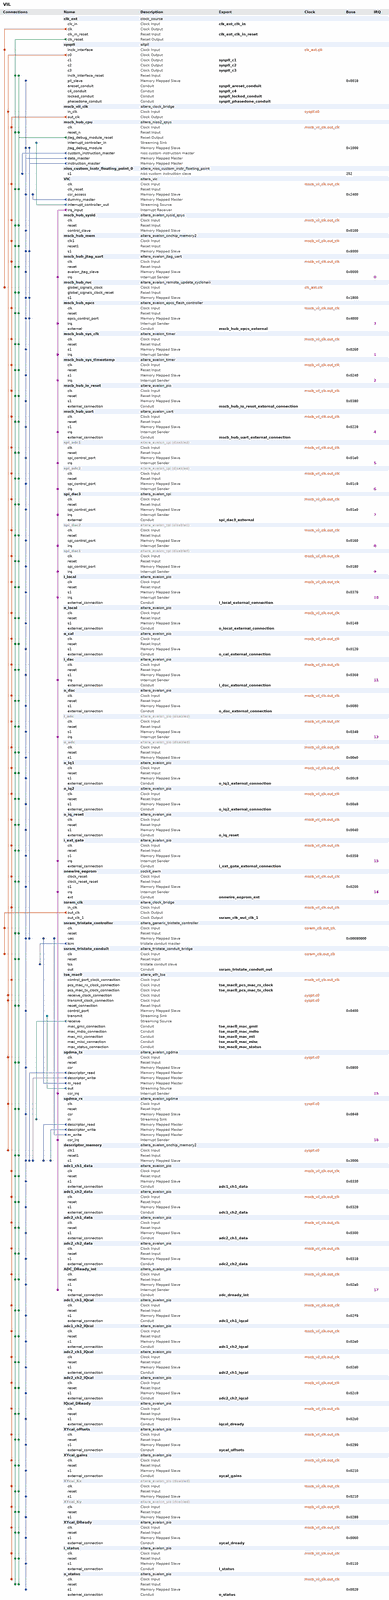
[diagram p0: system contents, whole]
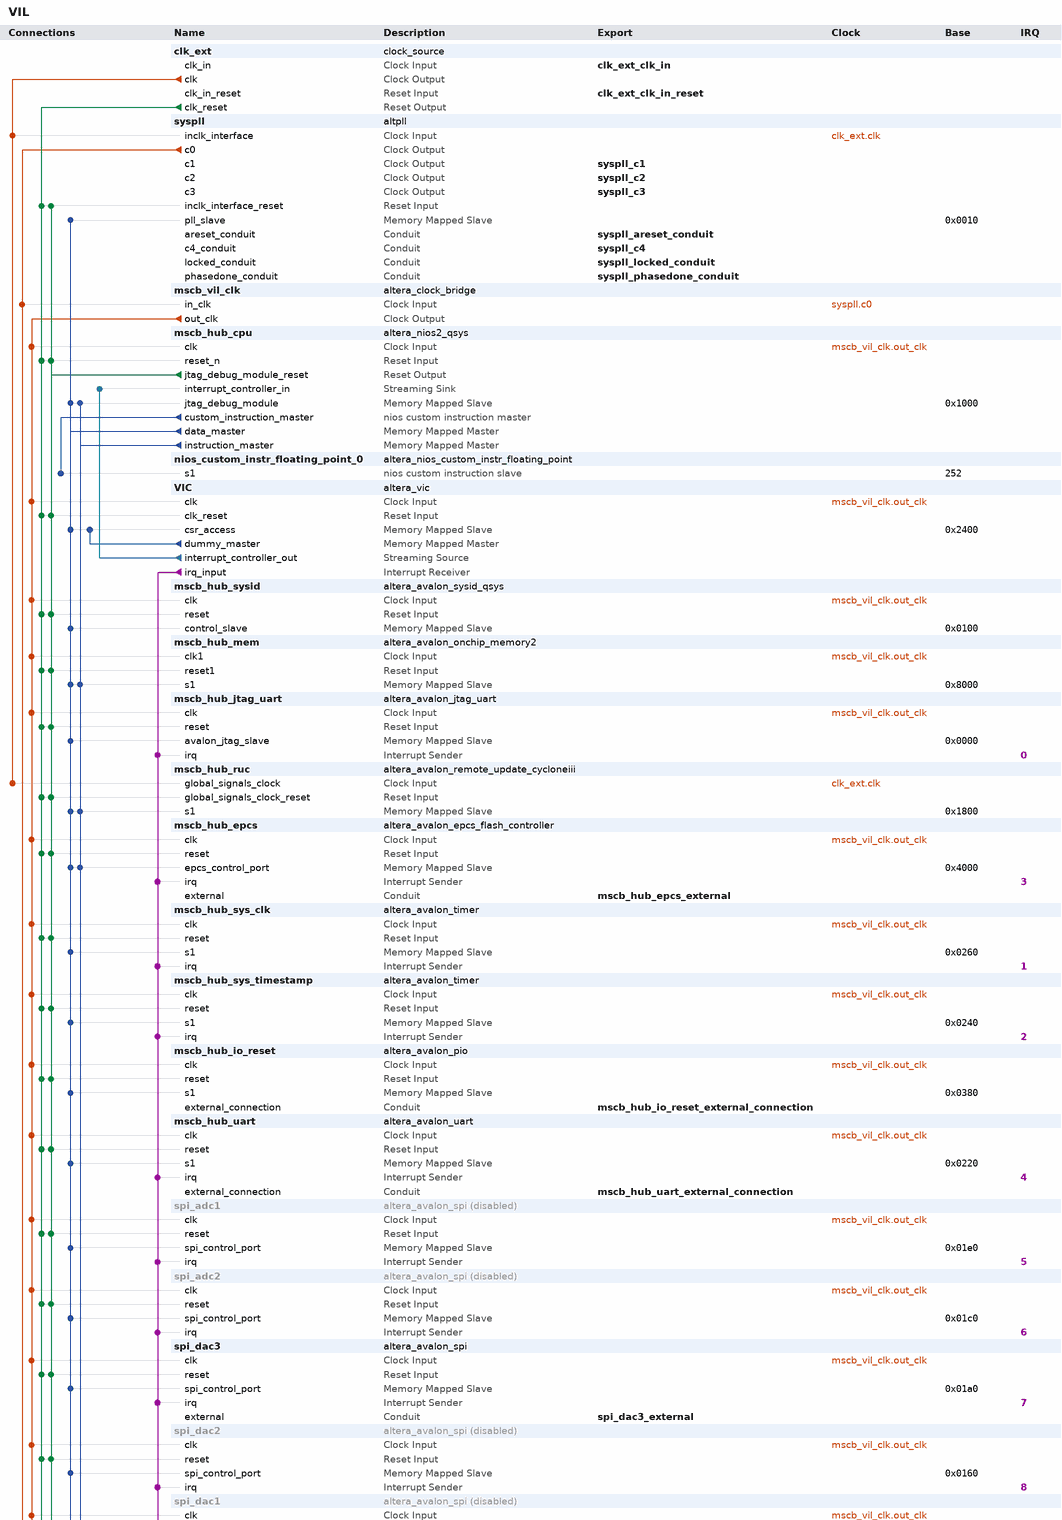
[diagram p1: system contents, upper part]
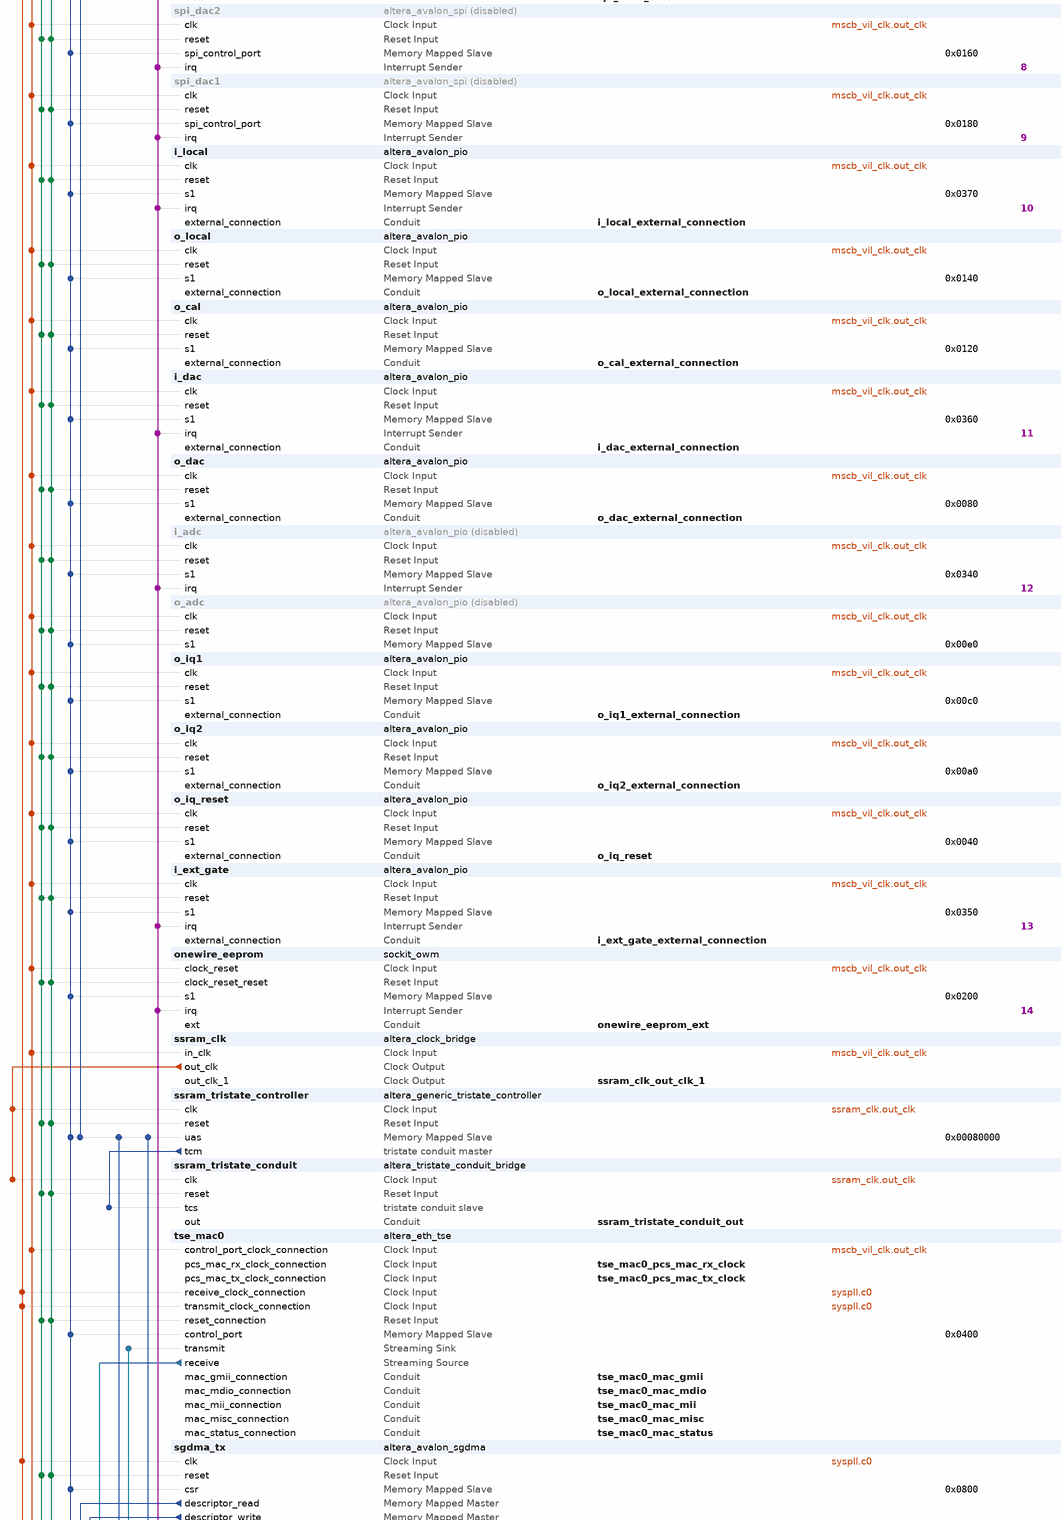
[diagram p2: system contents, middle part]
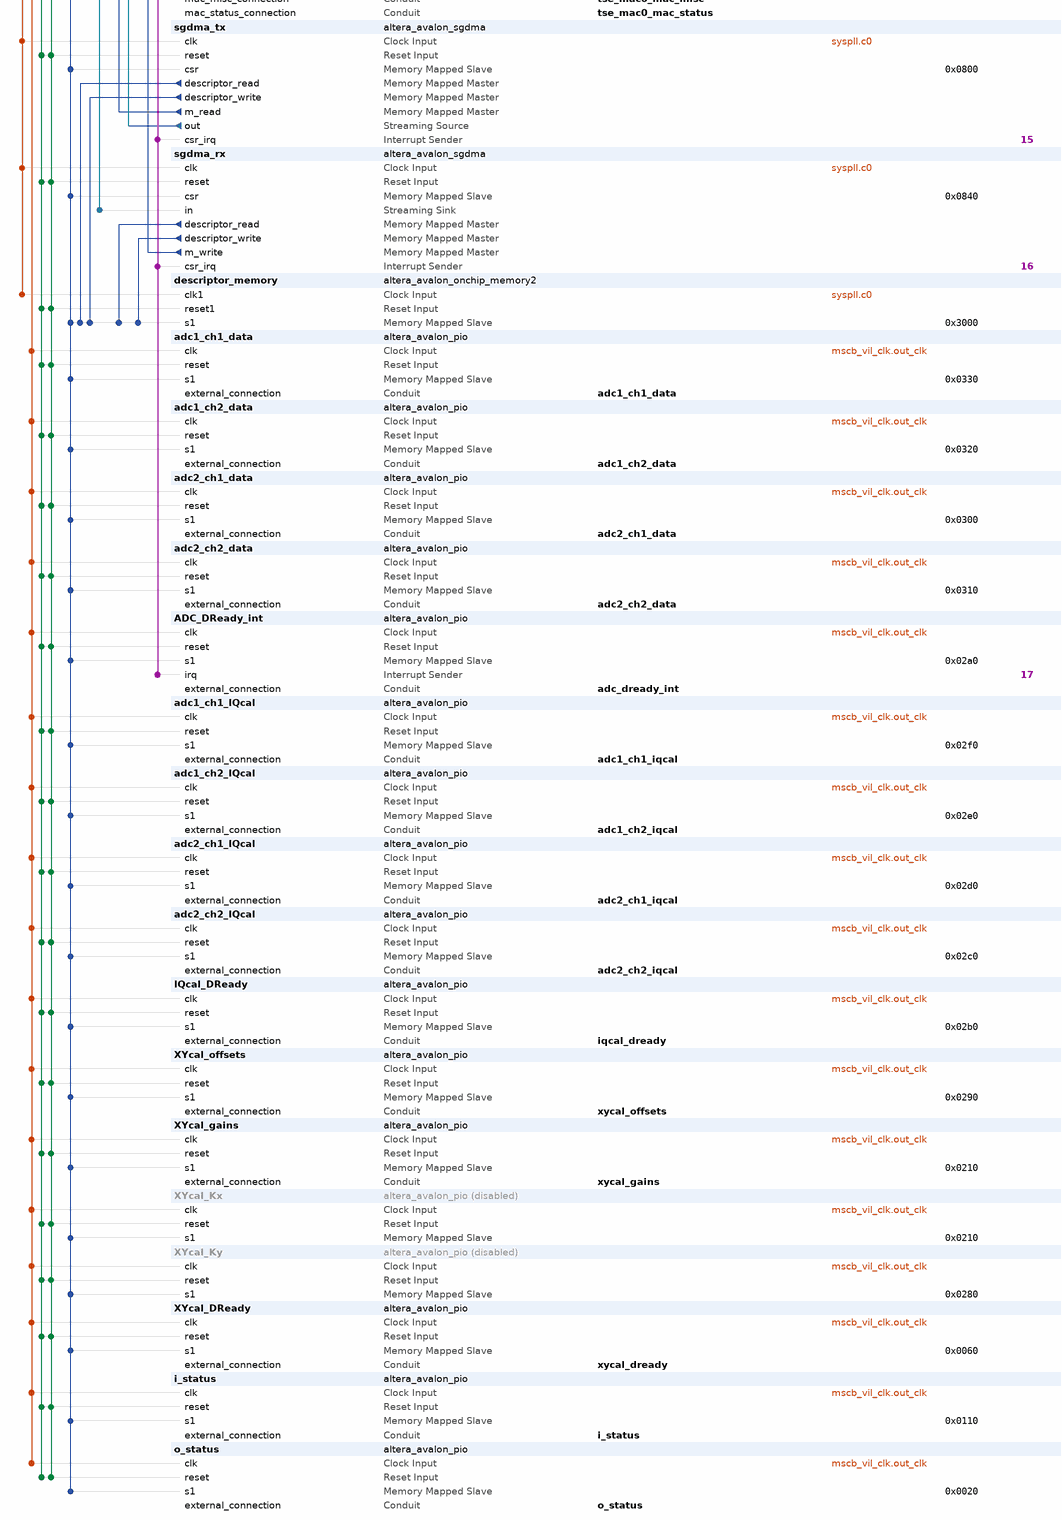
[diagram p3: system contents, lower part]
# Platform Designer (Qsys) system VIL, Cyclone IV E EP4CE75F23C7
# Parameters at their usual value, and those the tool derives, are not listed.
package require -exact qsys 13.0.1
create_system VIL
set_project_property DEVICE_FAMILY {Cyclone IV E}
set_project_property DEVICE EP4CE75F23C7

add_instance clk_ext clock_source 13.0
set_instance_parameter_value clk_ext clockFrequency 20000000

add_instance syspll altpll 13.0
set_instance_parameter_value syspll INCLK0_INPUT_FREQUENCY 50000
set_instance_parameter_value syspll OPERATION_MODE NO_COMPENSATION
set_instance_parameter_value syspll CLK0_MULTIPLY_BY 5
set_instance_parameter_value syspll CLK1_MULTIPLY_BY 5
set_instance_parameter_value syspll CLK2_MULTIPLY_BY 10
set_instance_parameter_value syspll CLK3_MULTIPLY_BY 5
set_instance_parameter_value syspll CLK4_MULTIPLY_BY 1
set_instance_parameter_value syspll CLK0_DIVIDE_BY 1
set_instance_parameter_value syspll CLK1_DIVIDE_BY 1
set_instance_parameter_value syspll CLK2_DIVIDE_BY 1
set_instance_parameter_value syspll CLK3_DIVIDE_BY 4
set_instance_parameter_value syspll CLK4_DIVIDE_BY 20
set_instance_parameter_value syspll CLK1_PHASE_SHIFT -5000
set_instance_parameter_value syspll CLK2_PHASE_SHIFT 0
set_instance_parameter_value syspll CLK3_PHASE_SHIFT 0
set_instance_parameter_value syspll CLK4_PHASE_SHIFT 0
set_instance_parameter_value syspll CLK1_DUTY_CYCLE 50
set_instance_parameter_value syspll CLK2_DUTY_CYCLE 50
set_instance_parameter_value syspll CLK3_DUTY_CYCLE 50
set_instance_parameter_value syspll CLK4_DUTY_CYCLE 50
set_instance_parameter_value syspll PORT_clk1 PORT_USED
set_instance_parameter_value syspll PORT_clk2 PORT_USED
set_instance_parameter_value syspll PORT_clk3 PORT_USED
set_instance_parameter_value syspll PORT_ARESET PORT_USED
set_instance_parameter_value syspll PORT_LOCKED PORT_USED

add_instance mscb_vil_clk altera_clock_bridge 13.0
set_instance_parameter_value mscb_vil_clk DERIVED_CLOCK_RATE 100000000
set_instance_parameter_value mscb_vil_clk EXPLICIT_CLOCK_RATE 0

add_instance mscb_hub_cpu altera_nios2_qsys 13.0
set_instance_parameter_value mscb_hub_cpu setting_preciseIllegalMemAccessException true
set_instance_parameter_value mscb_hub_cpu setting_preciseDivisionErrorException true
set_instance_parameter_value mscb_hub_cpu setting_illegalInstructionsTrap true
set_instance_parameter_value mscb_hub_cpu setting_extraExceptionInfo true
set_instance_parameter_value mscb_hub_cpu muldiv_divider true
set_instance_parameter_value mscb_hub_cpu setting_shadowRegisterSets 8
set_instance_parameter_value mscb_hub_cpu mpu_numOfInstRegion 4
set_instance_parameter_value mscb_hub_cpu resetSlave mscb_hub_epcs.epcs_control_port
set_instance_parameter_value mscb_hub_cpu exceptionSlave mscb_hub_mem.s1
set_instance_parameter_value mscb_hub_cpu breakSlave mscb_hub_cpu.jtag_debug_module
set_instance_parameter_value mscb_hub_cpu setting_interruptControllerType External
set_instance_parameter_value mscb_hub_cpu mpu_minInstRegionSize 14
set_instance_parameter_value mscb_hub_cpu mpu_minDataRegionSize 14
set_instance_parameter_value mscb_hub_cpu impl Fast
set_instance_parameter_value mscb_hub_cpu icache_size 16384
set_instance_parameter_value mscb_hub_cpu icache_burstType Sequential
set_instance_parameter_value mscb_hub_cpu debug_level Level3
set_instance_parameter_value mscb_hub_cpu debug_OCIOnchipTrace _256
set_instance_parameter_value mscb_hub_cpu dcache_size 8192
set_instance_parameter_value mscb_hub_cpu dcache_lineSize 16

add_instance nios_custom_instr_floating_point_0 altera_nios_custom_instr_floating_point 13.0

add_instance VIC altera_vic 13.0
set_instance_parameter_value VIC NUMBER_OF_INT_PORTS 24
set_instance_parameter_value VIC RIL_WIDTH 4
set_instance_parameter_value VIC DAISY_CHAIN_ENABLE 0

add_instance mscb_hub_sysid altera_avalon_sysid_qsys 13.0
set_instance_parameter_value mscb_hub_sysid id 19780106

add_instance mscb_hub_mem altera_avalon_onchip_memory2 13.0.1
set_instance_parameter_value mscb_hub_mem dataWidth 32
set_instance_parameter_value mscb_hub_mem dualPort false
set_instance_parameter_value mscb_hub_mem initMemContent true
set_instance_parameter_value mscb_hub_mem initializationFileName mscb_hub_mem
set_instance_parameter_value mscb_hub_mem memorySize 16384

add_instance mscb_hub_jtag_uart altera_avalon_jtag_uart 13.0.1
set_instance_parameter_value mscb_hub_jtag_uart simInteractiveOptions INTERACTIVE_ASCII_OUTPUT

add_instance mscb_hub_ruc altera_avalon_remote_update_cycloneiii 13.0
set_instance_parameter_value mscb_hub_ruc clockFrequency 20000000

add_instance mscb_hub_epcs altera_avalon_epcs_flash_controller 13.0.1
set_instance_parameter_value mscb_hub_epcs autoSelectASMIAtom false

add_instance mscb_hub_sys_clk altera_avalon_timer 13.0.1
set_instance_parameter_value mscb_hub_sys_clk period 1
set_instance_parameter_value mscb_hub_sys_clk periodUnits MSEC

add_instance mscb_hub_sys_timestamp altera_avalon_timer 13.0.1
set_instance_parameter_value mscb_hub_sys_timestamp period 1
set_instance_parameter_value mscb_hub_sys_timestamp periodUnits MSEC

add_instance mscb_hub_io_reset altera_avalon_pio 13.0.1
set_instance_parameter_value mscb_hub_io_reset captureEdge true
set_instance_parameter_value mscb_hub_io_reset direction InOut
set_instance_parameter_value mscb_hub_io_reset simDoTestBenchWiring true
set_instance_parameter_value mscb_hub_io_reset width 1

add_instance mscb_hub_uart altera_avalon_uart 13.0.1
set_instance_parameter_value mscb_hub_uart baud 115200
set_instance_parameter_value mscb_hub_uart dataBits 8
set_instance_parameter_value mscb_hub_uart fixedBaud false
set_instance_parameter_value mscb_hub_uart parity NONE
set_instance_parameter_value mscb_hub_uart stopBits 1
set_instance_parameter_value mscb_hub_uart useCtsRts true
set_instance_parameter_value mscb_hub_uart useEopRegister true

add_instance spi_adc1 altera_avalon_spi 13.0.1
set_instance_property spi_adc1 ENABLED false
set_instance_parameter_value spi_adc1 clockPhase 1
set_instance_parameter_value spi_adc1 clockPolarity 1
set_instance_parameter_value spi_adc1 dataWidth 28
set_instance_parameter_value spi_adc1 masterSPI true
set_instance_parameter_value spi_adc1 numberOfSlaves 1
set_instance_parameter_value spi_adc1 targetClockRate 25000000

add_instance spi_adc2 altera_avalon_spi 13.0.1
set_instance_property spi_adc2 ENABLED false
set_instance_parameter_value spi_adc2 clockPhase 1
set_instance_parameter_value spi_adc2 clockPolarity 1
set_instance_parameter_value spi_adc2 dataWidth 28
set_instance_parameter_value spi_adc2 masterSPI true
set_instance_parameter_value spi_adc2 numberOfSlaves 1
set_instance_parameter_value spi_adc2 targetClockRate 25000000

add_instance spi_dac3 altera_avalon_spi 13.0.1
set_instance_parameter_value spi_dac3 clockPolarity 0
set_instance_parameter_value spi_dac3 dataWidth 32
set_instance_parameter_value spi_dac3 masterSPI true
set_instance_parameter_value spi_dac3 numberOfSlaves 1
set_instance_parameter_value spi_dac3 targetClockRate 25000000

add_instance spi_dac2 altera_avalon_spi 13.0.1
set_instance_property spi_dac2 ENABLED false
set_instance_parameter_value spi_dac2 clockPolarity 0
set_instance_parameter_value spi_dac2 dataWidth 32
set_instance_parameter_value spi_dac2 masterSPI true
set_instance_parameter_value spi_dac2 numberOfSlaves 1
set_instance_parameter_value spi_dac2 targetClockRate 25000000

add_instance spi_dac1 altera_avalon_spi 13.0.1
set_instance_property spi_dac1 ENABLED false
set_instance_parameter_value spi_dac1 clockPolarity 0
set_instance_parameter_value spi_dac1 dataWidth 32
set_instance_parameter_value spi_dac1 masterSPI true
set_instance_parameter_value spi_dac1 numberOfSlaves 1
set_instance_parameter_value spi_dac1 targetClockRate 25000000

add_instance i_local altera_avalon_pio 13.0.1
set_instance_parameter_value i_local captureEdge true
set_instance_parameter_value i_local direction Input
set_instance_parameter_value i_local edgeType ANY
set_instance_parameter_value i_local generateIRQ true
set_instance_parameter_value i_local irqType EDGE
set_instance_parameter_value i_local simDoTestBenchWiring true
set_instance_parameter_value i_local width 1

add_instance o_local altera_avalon_pio 13.0.1
set_instance_parameter_value o_local bitModifyingOutReg true
set_instance_parameter_value o_local direction Output
set_instance_parameter_value o_local width 7

add_instance o_cal altera_avalon_pio 13.0.1
set_instance_parameter_value o_cal bitModifyingOutReg true
set_instance_parameter_value o_cal direction Output
set_instance_parameter_value o_cal width 15

add_instance i_dac altera_avalon_pio 13.0.1
set_instance_parameter_value i_dac bitClearingEdgeCapReg true
set_instance_parameter_value i_dac captureEdge true
set_instance_parameter_value i_dac direction Input
set_instance_parameter_value i_dac edgeType FALLING
set_instance_parameter_value i_dac generateIRQ true
set_instance_parameter_value i_dac irqType EDGE
set_instance_parameter_value i_dac simDoTestBenchWiring true
set_instance_parameter_value i_dac width 3

add_instance o_dac altera_avalon_pio 13.0.1
set_instance_parameter_value o_dac bitModifyingOutReg true
set_instance_parameter_value o_dac direction Output
set_instance_parameter_value o_dac width 6

add_instance i_adc altera_avalon_pio 13.0.1
set_instance_property i_adc ENABLED false
set_instance_parameter_value i_adc bitClearingEdgeCapReg true
set_instance_parameter_value i_adc captureEdge true
set_instance_parameter_value i_adc direction Input
set_instance_parameter_value i_adc edgeType FALLING
set_instance_parameter_value i_adc generateIRQ true
set_instance_parameter_value i_adc irqType EDGE
set_instance_parameter_value i_adc simDoTestBenchWiring true
set_instance_parameter_value i_adc width 2

add_instance o_adc altera_avalon_pio 13.0.1
set_instance_property o_adc ENABLED false
set_instance_parameter_value o_adc bitModifyingOutReg true
set_instance_parameter_value o_adc direction Output
set_instance_parameter_value o_adc width 8

add_instance o_iq1 altera_avalon_pio 13.0.1
set_instance_parameter_value o_iq1 bitModifyingOutReg true
set_instance_parameter_value o_iq1 direction Output
set_instance_parameter_value o_iq1 width 17

add_instance o_iq2 altera_avalon_pio 13.0.1
set_instance_parameter_value o_iq2 bitModifyingOutReg true
set_instance_parameter_value o_iq2 direction Output
set_instance_parameter_value o_iq2 width 17

add_instance o_iq_reset altera_avalon_pio 13.0.1
set_instance_parameter_value o_iq_reset bitModifyingOutReg true
set_instance_parameter_value o_iq_reset direction Output
set_instance_parameter_value o_iq_reset width 1

add_instance i_ext_gate altera_avalon_pio 13.0.1
set_instance_parameter_value i_ext_gate bitClearingEdgeCapReg true
set_instance_parameter_value i_ext_gate captureEdge true
set_instance_parameter_value i_ext_gate direction Input
set_instance_parameter_value i_ext_gate edgeType FALLING
set_instance_parameter_value i_ext_gate generateIRQ true
set_instance_parameter_value i_ext_gate irqType EDGE
set_instance_parameter_value i_ext_gate simDoTestBenchWiring true
set_instance_parameter_value i_ext_gate width 1

add_instance onewire_eeprom sockit_owm 1.3
set_instance_parameter_value onewire_eeprom OVD_E true
set_instance_parameter_value onewire_eeprom CDR_E true
set_instance_parameter_value onewire_eeprom BDW 32
set_instance_parameter_value onewire_eeprom BAW 1
set_instance_parameter_value onewire_eeprom OWN 1
set_instance_parameter_value onewire_eeprom BTP_N 5.0
set_instance_parameter_value onewire_eeprom BTP_O 1.0
set_instance_parameter_value onewire_eeprom F_CLK 100000000

add_instance ssram_clk altera_clock_bridge 13.0
set_instance_parameter_value ssram_clk DERIVED_CLOCK_RATE 100000000
set_instance_parameter_value ssram_clk EXPLICIT_CLOCK_RATE 0
set_instance_parameter_value ssram_clk NUM_CLOCK_OUTPUTS 2

add_instance ssram_tristate_controller altera_generic_tristate_controller 13.0
set_instance_parameter_value ssram_tristate_controller TCM_ADDRESS_W 19
set_instance_parameter_value ssram_tristate_controller TCM_DATA_W 32
set_instance_parameter_value ssram_tristate_controller TCM_BYTEENABLE_W 4
set_instance_parameter_value ssram_tristate_controller TCM_READ_WAIT 1
set_instance_parameter_value ssram_tristate_controller TCM_WRITE_WAIT 0
set_instance_parameter_value ssram_tristate_controller TCM_SETUP_WAIT 0
set_instance_parameter_value ssram_tristate_controller TCM_DATA_HOLD 0
set_instance_parameter_value ssram_tristate_controller TCM_MAX_PENDING_READ_TRANSACTIONS 5
set_instance_parameter_value ssram_tristate_controller TCM_TURNAROUND_TIME 2
set_instance_parameter_value ssram_tristate_controller TCM_TIMING_UNITS 1
set_instance_parameter_value ssram_tristate_controller TCM_READLATENCY 3
set_instance_parameter_value ssram_tristate_controller TCM_SYMBOLS_PER_WORD 4
set_instance_parameter_value ssram_tristate_controller USE_READ 1
set_instance_parameter_value ssram_tristate_controller USE_BEGINTRANSFER 0
set_instance_parameter_value ssram_tristate_controller USE_BYTEENABLE 1
set_instance_parameter_value ssram_tristate_controller USE_OUTPUTENABLE 1
set_instance_parameter_value ssram_tristate_controller USE_RESET_OUTPUT 1
set_instance_parameter_value ssram_tristate_controller ACTIVE_LOW_READ 0
set_instance_parameter_value ssram_tristate_controller ACTIVE_LOW_BYTEENABLE 1
set_instance_parameter_value ssram_tristate_controller ACTIVE_LOW_OUTPUTENABLE 1
set_instance_parameter_value ssram_tristate_controller ACTIVE_LOW_BEGINTRANSFER 1
set_instance_parameter_value ssram_tristate_controller ACTIVE_LOW_RESET_OUTPUT 1
set_instance_parameter_value ssram_tristate_controller CHIPSELECT_THROUGH_READLATENCY 1
set_instance_parameter_value ssram_tristate_controller MODULE_ASSIGNMENT_KEYS embeddedsw.configuration.hwClassnameDriverSupportList,embeddedsw.CMacro.SRAM_MEMORY_SIZE,embeddedsw.CMacro.SRAM_MEMORY_UNITS,embeddedsw.CMacro.SSRAM_DATA_WIDTH,embeddedsw.CMacro.SSRAM_READ_LATENCY,embeddedsw.memoryInfo.MEM_INIT_DATA_WIDTH,embeddedsw.memoryInfo.HAS_BYTE_LANE,embeddedsw.memoryInfo.GENERATE_DAT_SYM,embeddedsw.memoryInfo.DAT_SYM_INSTALL_DIR
set_instance_parameter_value ssram_tristate_controller MODULE_ASSIGNMENT_VALUES altera_avalon_lan91c111:altera_avalon_cfi_flash,4,131072,32,1,32,1,1,SIM_DIR

add_instance ssram_tristate_conduit altera_tristate_conduit_bridge 13.0

add_instance tse_mac0 altera_eth_tse 13.0
set_instance_parameter_value tse_mac0 core_variation MAC_ONLY
set_instance_parameter_value tse_mac0 ifGMII MII_GMII
set_instance_parameter_value tse_mac0 transceiver_type NONE
set_instance_parameter_value tse_mac0 enable_hd_logic true
set_instance_parameter_value tse_mac0 enable_gmii_loopback true
set_instance_parameter_value tse_mac0 enable_sup_addr true
set_instance_parameter_value tse_mac0 stat_cnt_ena true
set_instance_parameter_value tse_mac0 ext_stat_cnt_ena true
set_instance_parameter_value tse_mac0 ena_hash true
set_instance_parameter_value tse_mac0 enable_shift16 true
set_instance_parameter_value tse_mac0 enable_mac_flow_ctrl true
set_instance_parameter_value tse_mac0 enable_mac_vlan true
set_instance_parameter_value tse_mac0 enable_magic_detect true
set_instance_parameter_value tse_mac0 mdio_clk_div 40
set_instance_parameter_value tse_mac0 ing_addr 11

add_instance sgdma_tx altera_avalon_sgdma 13.0.1
set_instance_parameter_value sgdma_tx enableBurstTransfers false
set_instance_parameter_value sgdma_tx enableUnalignedTransfers false
set_instance_parameter_value sgdma_tx readBlockDataWidth 32
set_instance_parameter_value sgdma_tx sinkErrorWidth 0
set_instance_parameter_value sgdma_tx sourceErrorWidth 1
set_instance_parameter_value sgdma_tx transferMode MEMORY_TO_STREAM
set_instance_parameter_value sgdma_tx writeBurstcountWidth 4

add_instance sgdma_rx altera_avalon_sgdma 13.0.1
set_instance_parameter_value sgdma_rx enableBurstTransfers false
set_instance_parameter_value sgdma_rx enableUnalignedTransfers false
set_instance_parameter_value sgdma_rx readBlockDataWidth 32
set_instance_parameter_value sgdma_rx sinkErrorWidth 6
set_instance_parameter_value sgdma_rx sourceErrorWidth 0
set_instance_parameter_value sgdma_rx transferMode STREAM_TO_MEMORY
set_instance_parameter_value sgdma_rx writeBurstcountWidth 4

add_instance descriptor_memory altera_avalon_onchip_memory2 13.0.1
set_instance_parameter_value descriptor_memory dataWidth 32
set_instance_parameter_value descriptor_memory dualPort false
set_instance_parameter_value descriptor_memory initMemContent true
set_instance_parameter_value descriptor_memory initializationFileName descriptor_memory
set_instance_parameter_value descriptor_memory memorySize 4096

add_instance adc1_ch1_data altera_avalon_pio 13.0.1
set_instance_parameter_value adc1_ch1_data direction Input
set_instance_parameter_value adc1_ch1_data simDoTestBenchWiring true
set_instance_parameter_value adc1_ch1_data width 28

add_instance adc1_ch2_data altera_avalon_pio 13.0.1
set_instance_parameter_value adc1_ch2_data direction Input
set_instance_parameter_value adc1_ch2_data simDoTestBenchWiring true
set_instance_parameter_value adc1_ch2_data width 28

add_instance adc2_ch1_data altera_avalon_pio 13.0.1
set_instance_parameter_value adc2_ch1_data direction Input
set_instance_parameter_value adc2_ch1_data simDoTestBenchWiring true
set_instance_parameter_value adc2_ch1_data width 28

add_instance adc2_ch2_data altera_avalon_pio 13.0.1
set_instance_parameter_value adc2_ch2_data direction Input
set_instance_parameter_value adc2_ch2_data simDoTestBenchWiring true
set_instance_parameter_value adc2_ch2_data width 28

add_instance ADC_DReady_int altera_avalon_pio 13.0.1
set_instance_parameter_value ADC_DReady_int captureEdge true
set_instance_parameter_value ADC_DReady_int direction Input
set_instance_parameter_value ADC_DReady_int generateIRQ true
set_instance_parameter_value ADC_DReady_int irqType EDGE
set_instance_parameter_value ADC_DReady_int simDoTestBenchWiring true
set_instance_parameter_value ADC_DReady_int width 1

add_instance adc1_ch1_IQcal altera_avalon_pio 13.0.1
set_instance_parameter_value adc1_ch1_IQcal direction Output
set_instance_parameter_value adc1_ch1_IQcal width 32

add_instance adc1_ch2_IQcal altera_avalon_pio 13.0.1
set_instance_parameter_value adc1_ch2_IQcal direction Output
set_instance_parameter_value adc1_ch2_IQcal width 32

add_instance adc2_ch1_IQcal altera_avalon_pio 13.0.1
set_instance_parameter_value adc2_ch1_IQcal direction Output
set_instance_parameter_value adc2_ch1_IQcal width 32

add_instance adc2_ch2_IQcal altera_avalon_pio 13.0.1
set_instance_parameter_value adc2_ch2_IQcal direction Output
set_instance_parameter_value adc2_ch2_IQcal width 32

add_instance IQcal_DReady altera_avalon_pio 13.0.1
set_instance_parameter_value IQcal_DReady direction Output
set_instance_parameter_value IQcal_DReady width 1

add_instance XYcal_offsets altera_avalon_pio 13.0.1
set_instance_parameter_value XYcal_offsets direction Output
set_instance_parameter_value XYcal_offsets width 32

add_instance XYcal_gains altera_avalon_pio 13.0.1
set_instance_parameter_value XYcal_gains direction Output
set_instance_parameter_value XYcal_gains width 32

add_instance XYcal_Kx altera_avalon_pio 13.0.1
set_instance_property XYcal_Kx ENABLED false
set_instance_parameter_value XYcal_Kx direction Output
set_instance_parameter_value XYcal_Kx width 32

add_instance XYcal_Ky altera_avalon_pio 13.0.1
set_instance_property XYcal_Ky ENABLED false
set_instance_parameter_value XYcal_Ky direction Output
set_instance_parameter_value XYcal_Ky width 32

add_instance XYcal_DReady altera_avalon_pio 13.0.1
set_instance_parameter_value XYcal_DReady bitModifyingOutReg true
set_instance_parameter_value XYcal_DReady direction Output
set_instance_parameter_value XYcal_DReady width 2

add_instance i_status altera_avalon_pio 13.0.1
set_instance_parameter_value i_status direction Input
set_instance_parameter_value i_status simDoTestBenchWiring true
set_instance_parameter_value i_status width 16

add_instance o_status altera_avalon_pio 13.0.1
set_instance_parameter_value o_status bitModifyingOutReg true
set_instance_parameter_value o_status direction Output
set_instance_parameter_value o_status width 16

# connections
add_connection clk_ext.clk mscb_hub_ruc.global_signals_clock clock
add_connection clk_ext.clk syspll.inclk_interface clock
add_connection mscb_vil_clk.out_clk adc1_ch1_data.clk clock
add_connection mscb_vil_clk.out_clk adc1_ch1_IQcal.clk clock
add_connection mscb_vil_clk.out_clk adc1_ch2_data.clk clock
add_connection mscb_vil_clk.out_clk adc1_ch2_IQcal.clk clock
add_connection mscb_vil_clk.out_clk adc2_ch1_data.clk clock
add_connection mscb_vil_clk.out_clk adc2_ch1_IQcal.clk clock
add_connection mscb_vil_clk.out_clk adc2_ch2_data.clk clock
add_connection mscb_vil_clk.out_clk adc2_ch2_IQcal.clk clock
add_connection mscb_vil_clk.out_clk ADC_DReady_int.clk clock
add_connection mscb_vil_clk.out_clk i_adc.clk clock
add_connection mscb_vil_clk.out_clk i_dac.clk clock
add_connection mscb_vil_clk.out_clk i_ext_gate.clk clock
add_connection mscb_vil_clk.out_clk i_local.clk clock
add_connection mscb_vil_clk.out_clk i_status.clk clock
add_connection mscb_vil_clk.out_clk IQcal_DReady.clk clock
add_connection mscb_vil_clk.out_clk mscb_hub_cpu.clk clock
add_connection mscb_vil_clk.out_clk mscb_hub_epcs.clk clock
add_connection mscb_vil_clk.out_clk mscb_hub_io_reset.clk clock
add_connection mscb_vil_clk.out_clk mscb_hub_jtag_uart.clk clock
add_connection mscb_vil_clk.out_clk mscb_hub_mem.clk1 clock
add_connection mscb_vil_clk.out_clk mscb_hub_sys_clk.clk clock
add_connection mscb_vil_clk.out_clk mscb_hub_sys_timestamp.clk clock
add_connection mscb_vil_clk.out_clk mscb_hub_sysid.clk clock
add_connection mscb_vil_clk.out_clk mscb_hub_uart.clk clock
add_connection mscb_vil_clk.out_clk o_adc.clk clock
add_connection mscb_vil_clk.out_clk o_cal.clk clock
add_connection mscb_vil_clk.out_clk o_dac.clk clock
add_connection mscb_vil_clk.out_clk o_iq1.clk clock
add_connection mscb_vil_clk.out_clk o_iq2.clk clock
add_connection mscb_vil_clk.out_clk o_iq_reset.clk clock
add_connection mscb_vil_clk.out_clk o_local.clk clock
add_connection mscb_vil_clk.out_clk o_status.clk clock
add_connection mscb_vil_clk.out_clk onewire_eeprom.clock_reset clock
add_connection mscb_vil_clk.out_clk spi_adc1.clk clock
add_connection mscb_vil_clk.out_clk spi_adc2.clk clock
add_connection mscb_vil_clk.out_clk spi_dac1.clk clock
add_connection mscb_vil_clk.out_clk spi_dac2.clk clock
add_connection mscb_vil_clk.out_clk spi_dac3.clk clock
add_connection mscb_vil_clk.out_clk ssram_clk.in_clk clock
add_connection mscb_vil_clk.out_clk tse_mac0.control_port_clock_connection clock
add_connection mscb_vil_clk.out_clk VIC.clk clock
add_connection mscb_vil_clk.out_clk XYcal_DReady.clk clock
add_connection mscb_vil_clk.out_clk XYcal_gains.clk clock
add_connection mscb_vil_clk.out_clk XYcal_Kx.clk clock
add_connection mscb_vil_clk.out_clk XYcal_Ky.clk clock
add_connection mscb_vil_clk.out_clk XYcal_offsets.clk clock
add_connection ssram_clk.out_clk ssram_tristate_conduit.clk clock
add_connection ssram_clk.out_clk ssram_tristate_controller.clk clock
add_connection syspll.c0 descriptor_memory.clk1 clock
add_connection syspll.c0 mscb_vil_clk.in_clk clock
add_connection syspll.c0 sgdma_rx.clk clock
add_connection syspll.c0 sgdma_tx.clk clock
add_connection syspll.c0 tse_mac0.receive_clock_connection clock
add_connection syspll.c0 tse_mac0.transmit_clock_connection clock
add_connection clk_ext.clk_reset adc1_ch1_data.reset reset
add_connection clk_ext.clk_reset adc1_ch1_IQcal.reset reset
add_connection clk_ext.clk_reset adc1_ch2_data.reset reset
add_connection clk_ext.clk_reset adc1_ch2_IQcal.reset reset
add_connection clk_ext.clk_reset adc2_ch1_data.reset reset
add_connection clk_ext.clk_reset adc2_ch1_IQcal.reset reset
add_connection clk_ext.clk_reset adc2_ch2_data.reset reset
add_connection clk_ext.clk_reset adc2_ch2_IQcal.reset reset
add_connection clk_ext.clk_reset ADC_DReady_int.reset reset
add_connection clk_ext.clk_reset descriptor_memory.reset1 reset
add_connection clk_ext.clk_reset i_adc.reset reset
add_connection clk_ext.clk_reset i_dac.reset reset
add_connection clk_ext.clk_reset i_ext_gate.reset reset
add_connection clk_ext.clk_reset i_local.reset reset
add_connection clk_ext.clk_reset i_status.reset reset
add_connection clk_ext.clk_reset IQcal_DReady.reset reset
add_connection clk_ext.clk_reset mscb_hub_cpu.reset_n reset
add_connection clk_ext.clk_reset mscb_hub_epcs.reset reset
add_connection clk_ext.clk_reset mscb_hub_io_reset.reset reset
add_connection clk_ext.clk_reset mscb_hub_jtag_uart.reset reset
add_connection clk_ext.clk_reset mscb_hub_mem.reset1 reset
add_connection clk_ext.clk_reset mscb_hub_ruc.global_signals_clock_reset reset
add_connection clk_ext.clk_reset mscb_hub_sys_clk.reset reset
add_connection clk_ext.clk_reset mscb_hub_sys_timestamp.reset reset
add_connection clk_ext.clk_reset mscb_hub_sysid.reset reset
add_connection clk_ext.clk_reset mscb_hub_uart.reset reset
add_connection clk_ext.clk_reset o_adc.reset reset
add_connection clk_ext.clk_reset o_cal.reset reset
add_connection clk_ext.clk_reset o_dac.reset reset
add_connection clk_ext.clk_reset o_iq1.reset reset
add_connection clk_ext.clk_reset o_iq2.reset reset
add_connection clk_ext.clk_reset o_iq_reset.reset reset
add_connection clk_ext.clk_reset o_local.reset reset
add_connection clk_ext.clk_reset o_status.reset reset
add_connection clk_ext.clk_reset onewire_eeprom.clock_reset_reset reset
add_connection clk_ext.clk_reset sgdma_rx.reset reset
add_connection clk_ext.clk_reset sgdma_tx.reset reset
add_connection clk_ext.clk_reset spi_adc1.reset reset
add_connection clk_ext.clk_reset spi_adc2.reset reset
add_connection clk_ext.clk_reset spi_dac1.reset reset
add_connection clk_ext.clk_reset spi_dac2.reset reset
add_connection clk_ext.clk_reset spi_dac3.reset reset
add_connection clk_ext.clk_reset ssram_tristate_conduit.reset reset
add_connection clk_ext.clk_reset ssram_tristate_controller.reset reset
add_connection clk_ext.clk_reset syspll.inclk_interface_reset reset
add_connection clk_ext.clk_reset tse_mac0.reset_connection reset
add_connection clk_ext.clk_reset VIC.clk_reset reset
add_connection clk_ext.clk_reset XYcal_DReady.reset reset
add_connection clk_ext.clk_reset XYcal_gains.reset reset
add_connection clk_ext.clk_reset XYcal_Kx.reset reset
add_connection clk_ext.clk_reset XYcal_Ky.reset reset
add_connection clk_ext.clk_reset XYcal_offsets.reset reset
add_connection mscb_hub_cpu.jtag_debug_module_reset adc1_ch1_data.reset reset
add_connection mscb_hub_cpu.jtag_debug_module_reset adc1_ch1_IQcal.reset reset
add_connection mscb_hub_cpu.jtag_debug_module_reset adc1_ch2_data.reset reset
add_connection mscb_hub_cpu.jtag_debug_module_reset adc1_ch2_IQcal.reset reset
add_connection mscb_hub_cpu.jtag_debug_module_reset adc2_ch1_data.reset reset
add_connection mscb_hub_cpu.jtag_debug_module_reset adc2_ch1_IQcal.reset reset
add_connection mscb_hub_cpu.jtag_debug_module_reset adc2_ch2_data.reset reset
add_connection mscb_hub_cpu.jtag_debug_module_reset adc2_ch2_IQcal.reset reset
add_connection mscb_hub_cpu.jtag_debug_module_reset ADC_DReady_int.reset reset
add_connection mscb_hub_cpu.jtag_debug_module_reset descriptor_memory.reset1 reset
add_connection mscb_hub_cpu.jtag_debug_module_reset i_adc.reset reset
add_connection mscb_hub_cpu.jtag_debug_module_reset i_dac.reset reset
add_connection mscb_hub_cpu.jtag_debug_module_reset i_ext_gate.reset reset
add_connection mscb_hub_cpu.jtag_debug_module_reset i_local.reset reset
add_connection mscb_hub_cpu.jtag_debug_module_reset i_status.reset reset
add_connection mscb_hub_cpu.jtag_debug_module_reset IQcal_DReady.reset reset
add_connection mscb_hub_cpu.jtag_debug_module_reset mscb_hub_cpu.reset_n reset
add_connection mscb_hub_cpu.jtag_debug_module_reset mscb_hub_epcs.reset reset
add_connection mscb_hub_cpu.jtag_debug_module_reset mscb_hub_io_reset.reset reset
add_connection mscb_hub_cpu.jtag_debug_module_reset mscb_hub_jtag_uart.reset reset
add_connection mscb_hub_cpu.jtag_debug_module_reset mscb_hub_mem.reset1 reset
add_connection mscb_hub_cpu.jtag_debug_module_reset mscb_hub_ruc.global_signals_clock_reset reset
add_connection mscb_hub_cpu.jtag_debug_module_reset mscb_hub_sys_clk.reset reset
add_connection mscb_hub_cpu.jtag_debug_module_reset mscb_hub_sys_timestamp.reset reset
add_connection mscb_hub_cpu.jtag_debug_module_reset mscb_hub_sysid.reset reset
add_connection mscb_hub_cpu.jtag_debug_module_reset mscb_hub_uart.reset reset
add_connection mscb_hub_cpu.jtag_debug_module_reset o_adc.reset reset
add_connection mscb_hub_cpu.jtag_debug_module_reset o_cal.reset reset
add_connection mscb_hub_cpu.jtag_debug_module_reset o_dac.reset reset
add_connection mscb_hub_cpu.jtag_debug_module_reset o_iq1.reset reset
add_connection mscb_hub_cpu.jtag_debug_module_reset o_iq2.reset reset
add_connection mscb_hub_cpu.jtag_debug_module_reset o_iq_reset.reset reset
add_connection mscb_hub_cpu.jtag_debug_module_reset o_local.reset reset
add_connection mscb_hub_cpu.jtag_debug_module_reset o_status.reset reset
add_connection mscb_hub_cpu.jtag_debug_module_reset onewire_eeprom.clock_reset_reset reset
add_connection mscb_hub_cpu.jtag_debug_module_reset sgdma_rx.reset reset
add_connection mscb_hub_cpu.jtag_debug_module_reset sgdma_tx.reset reset
add_connection mscb_hub_cpu.jtag_debug_module_reset spi_adc1.reset reset
add_connection mscb_hub_cpu.jtag_debug_module_reset spi_adc2.reset reset
add_connection mscb_hub_cpu.jtag_debug_module_reset spi_dac1.reset reset
add_connection mscb_hub_cpu.jtag_debug_module_reset spi_dac2.reset reset
add_connection mscb_hub_cpu.jtag_debug_module_reset spi_dac3.reset reset
add_connection mscb_hub_cpu.jtag_debug_module_reset ssram_tristate_conduit.reset reset
add_connection mscb_hub_cpu.jtag_debug_module_reset ssram_tristate_controller.reset reset
add_connection mscb_hub_cpu.jtag_debug_module_reset syspll.inclk_interface_reset reset
add_connection mscb_hub_cpu.jtag_debug_module_reset tse_mac0.reset_connection reset
add_connection mscb_hub_cpu.jtag_debug_module_reset VIC.clk_reset reset
add_connection mscb_hub_cpu.jtag_debug_module_reset XYcal_DReady.reset reset
add_connection mscb_hub_cpu.jtag_debug_module_reset XYcal_gains.reset reset
add_connection mscb_hub_cpu.jtag_debug_module_reset XYcal_Kx.reset reset
add_connection mscb_hub_cpu.jtag_debug_module_reset XYcal_Ky.reset reset
add_connection mscb_hub_cpu.jtag_debug_module_reset XYcal_offsets.reset reset
add_connection mscb_hub_cpu.data_master adc1_ch1_data.s1 avalon
set_connection_parameter_value mscb_hub_cpu.data_master/adc1_ch1_data.s1 baseAddress 0x0330
add_connection mscb_hub_cpu.data_master adc1_ch1_IQcal.s1 avalon
set_connection_parameter_value mscb_hub_cpu.data_master/adc1_ch1_IQcal.s1 baseAddress 0x02f0
add_connection mscb_hub_cpu.data_master adc1_ch2_data.s1 avalon
set_connection_parameter_value mscb_hub_cpu.data_master/adc1_ch2_data.s1 baseAddress 0x0320
add_connection mscb_hub_cpu.data_master adc1_ch2_IQcal.s1 avalon
set_connection_parameter_value mscb_hub_cpu.data_master/adc1_ch2_IQcal.s1 baseAddress 0x02e0
add_connection mscb_hub_cpu.data_master adc2_ch1_data.s1 avalon
set_connection_parameter_value mscb_hub_cpu.data_master/adc2_ch1_data.s1 baseAddress 0x0300
add_connection mscb_hub_cpu.data_master adc2_ch1_IQcal.s1 avalon
set_connection_parameter_value mscb_hub_cpu.data_master/adc2_ch1_IQcal.s1 baseAddress 0x02d0
add_connection mscb_hub_cpu.data_master adc2_ch2_data.s1 avalon
set_connection_parameter_value mscb_hub_cpu.data_master/adc2_ch2_data.s1 baseAddress 0x0310
add_connection mscb_hub_cpu.data_master adc2_ch2_IQcal.s1 avalon
set_connection_parameter_value mscb_hub_cpu.data_master/adc2_ch2_IQcal.s1 baseAddress 0x02c0
add_connection mscb_hub_cpu.data_master ADC_DReady_int.s1 avalon
set_connection_parameter_value mscb_hub_cpu.data_master/ADC_DReady_int.s1 baseAddress 0x02a0
add_connection mscb_hub_cpu.data_master descriptor_memory.s1 avalon
set_connection_parameter_value mscb_hub_cpu.data_master/descriptor_memory.s1 baseAddress 0x3000
add_connection mscb_hub_cpu.data_master i_adc.s1 avalon
set_connection_parameter_value mscb_hub_cpu.data_master/i_adc.s1 baseAddress 0x0340
add_connection mscb_hub_cpu.data_master i_dac.s1 avalon
set_connection_parameter_value mscb_hub_cpu.data_master/i_dac.s1 baseAddress 0x0360
add_connection mscb_hub_cpu.data_master i_ext_gate.s1 avalon
set_connection_parameter_value mscb_hub_cpu.data_master/i_ext_gate.s1 baseAddress 0x0350
add_connection mscb_hub_cpu.data_master i_local.s1 avalon
set_connection_parameter_value mscb_hub_cpu.data_master/i_local.s1 baseAddress 0x0370
add_connection mscb_hub_cpu.data_master i_status.s1 avalon
set_connection_parameter_value mscb_hub_cpu.data_master/i_status.s1 baseAddress 0x0110
add_connection mscb_hub_cpu.data_master IQcal_DReady.s1 avalon
set_connection_parameter_value mscb_hub_cpu.data_master/IQcal_DReady.s1 baseAddress 0x02b0
add_connection mscb_hub_cpu.data_master mscb_hub_cpu.jtag_debug_module avalon
set_connection_parameter_value mscb_hub_cpu.data_master/mscb_hub_cpu.jtag_debug_module baseAddress 0x1000
add_connection mscb_hub_cpu.data_master mscb_hub_epcs.epcs_control_port avalon
set_connection_parameter_value mscb_hub_cpu.data_master/mscb_hub_epcs.epcs_control_port baseAddress 0x4000
add_connection mscb_hub_cpu.data_master mscb_hub_io_reset.s1 avalon
set_connection_parameter_value mscb_hub_cpu.data_master/mscb_hub_io_reset.s1 baseAddress 0x0380
add_connection mscb_hub_cpu.data_master mscb_hub_jtag_uart.avalon_jtag_slave avalon
set_connection_parameter_value mscb_hub_cpu.data_master/mscb_hub_jtag_uart.avalon_jtag_slave baseAddress 0x0000
add_connection mscb_hub_cpu.data_master mscb_hub_mem.s1 avalon
set_connection_parameter_value mscb_hub_cpu.data_master/mscb_hub_mem.s1 baseAddress 0x8000
add_connection mscb_hub_cpu.data_master mscb_hub_ruc.s1 avalon
set_connection_parameter_value mscb_hub_cpu.data_master/mscb_hub_ruc.s1 baseAddress 0x1800
add_connection mscb_hub_cpu.data_master mscb_hub_sys_clk.s1 avalon
set_connection_parameter_value mscb_hub_cpu.data_master/mscb_hub_sys_clk.s1 baseAddress 0x0260
add_connection mscb_hub_cpu.data_master mscb_hub_sys_timestamp.s1 avalon
set_connection_parameter_value mscb_hub_cpu.data_master/mscb_hub_sys_timestamp.s1 baseAddress 0x0240
add_connection mscb_hub_cpu.data_master mscb_hub_sysid.control_slave avalon
set_connection_parameter_value mscb_hub_cpu.data_master/mscb_hub_sysid.control_slave baseAddress 0x0100
add_connection mscb_hub_cpu.data_master mscb_hub_uart.s1 avalon
set_connection_parameter_value mscb_hub_cpu.data_master/mscb_hub_uart.s1 baseAddress 0x0220
add_connection mscb_hub_cpu.data_master o_adc.s1 avalon
set_connection_parameter_value mscb_hub_cpu.data_master/o_adc.s1 baseAddress 0x00e0
add_connection mscb_hub_cpu.data_master o_cal.s1 avalon
set_connection_parameter_value mscb_hub_cpu.data_master/o_cal.s1 baseAddress 0x0120
add_connection mscb_hub_cpu.data_master o_dac.s1 avalon
set_connection_parameter_value mscb_hub_cpu.data_master/o_dac.s1 baseAddress 0x0080
add_connection mscb_hub_cpu.data_master o_iq1.s1 avalon
set_connection_parameter_value mscb_hub_cpu.data_master/o_iq1.s1 baseAddress 0x00c0
add_connection mscb_hub_cpu.data_master o_iq2.s1 avalon
set_connection_parameter_value mscb_hub_cpu.data_master/o_iq2.s1 baseAddress 0x00a0
add_connection mscb_hub_cpu.data_master o_iq_reset.s1 avalon
set_connection_parameter_value mscb_hub_cpu.data_master/o_iq_reset.s1 baseAddress 0x0040
add_connection mscb_hub_cpu.data_master o_local.s1 avalon
set_connection_parameter_value mscb_hub_cpu.data_master/o_local.s1 baseAddress 0x0140
add_connection mscb_hub_cpu.data_master o_status.s1 avalon
set_connection_parameter_value mscb_hub_cpu.data_master/o_status.s1 baseAddress 0x0020
add_connection mscb_hub_cpu.data_master onewire_eeprom.s1 avalon
set_connection_parameter_value mscb_hub_cpu.data_master/onewire_eeprom.s1 baseAddress 0x0200
add_connection mscb_hub_cpu.data_master sgdma_rx.csr avalon
set_connection_parameter_value mscb_hub_cpu.data_master/sgdma_rx.csr baseAddress 0x0840
add_connection mscb_hub_cpu.data_master sgdma_tx.csr avalon
set_connection_parameter_value mscb_hub_cpu.data_master/sgdma_tx.csr baseAddress 0x0800
add_connection mscb_hub_cpu.data_master spi_adc1.spi_control_port avalon
set_connection_parameter_value mscb_hub_cpu.data_master/spi_adc1.spi_control_port baseAddress 0x01e0
add_connection mscb_hub_cpu.data_master spi_adc2.spi_control_port avalon
set_connection_parameter_value mscb_hub_cpu.data_master/spi_adc2.spi_control_port baseAddress 0x01c0
add_connection mscb_hub_cpu.data_master spi_dac1.spi_control_port avalon
set_connection_parameter_value mscb_hub_cpu.data_master/spi_dac1.spi_control_port baseAddress 0x0180
add_connection mscb_hub_cpu.data_master spi_dac2.spi_control_port avalon
set_connection_parameter_value mscb_hub_cpu.data_master/spi_dac2.spi_control_port baseAddress 0x0160
add_connection mscb_hub_cpu.data_master spi_dac3.spi_control_port avalon
set_connection_parameter_value mscb_hub_cpu.data_master/spi_dac3.spi_control_port baseAddress 0x01a0
add_connection mscb_hub_cpu.data_master ssram_tristate_controller.uas avalon
set_connection_parameter_value mscb_hub_cpu.data_master/ssram_tristate_controller.uas baseAddress 0x00080000
add_connection mscb_hub_cpu.data_master syspll.pll_slave avalon
set_connection_parameter_value mscb_hub_cpu.data_master/syspll.pll_slave baseAddress 0x0010
add_connection mscb_hub_cpu.data_master tse_mac0.control_port avalon
set_connection_parameter_value mscb_hub_cpu.data_master/tse_mac0.control_port baseAddress 0x0400
add_connection mscb_hub_cpu.data_master VIC.csr_access avalon
set_connection_parameter_value mscb_hub_cpu.data_master/VIC.csr_access baseAddress 0x2400
add_connection mscb_hub_cpu.data_master XYcal_DReady.s1 avalon
set_connection_parameter_value mscb_hub_cpu.data_master/XYcal_DReady.s1 baseAddress 0x0060
add_connection mscb_hub_cpu.data_master XYcal_gains.s1 avalon
set_connection_parameter_value mscb_hub_cpu.data_master/XYcal_gains.s1 baseAddress 0x0210
add_connection mscb_hub_cpu.data_master XYcal_Kx.s1 avalon
set_connection_parameter_value mscb_hub_cpu.data_master/XYcal_Kx.s1 baseAddress 0x0210
add_connection mscb_hub_cpu.data_master XYcal_Ky.s1 avalon
set_connection_parameter_value mscb_hub_cpu.data_master/XYcal_Ky.s1 baseAddress 0x0280
add_connection mscb_hub_cpu.data_master XYcal_offsets.s1 avalon
set_connection_parameter_value mscb_hub_cpu.data_master/XYcal_offsets.s1 baseAddress 0x0290
add_connection mscb_hub_cpu.instruction_master mscb_hub_cpu.jtag_debug_module avalon
set_connection_parameter_value mscb_hub_cpu.instruction_master/mscb_hub_cpu.jtag_debug_module baseAddress 0x1000
add_connection mscb_hub_cpu.instruction_master mscb_hub_epcs.epcs_control_port avalon
set_connection_parameter_value mscb_hub_cpu.instruction_master/mscb_hub_epcs.epcs_control_port baseAddress 0x4000
add_connection mscb_hub_cpu.instruction_master mscb_hub_mem.s1 avalon
set_connection_parameter_value mscb_hub_cpu.instruction_master/mscb_hub_mem.s1 baseAddress 0x8000
add_connection mscb_hub_cpu.instruction_master mscb_hub_ruc.s1 avalon
set_connection_parameter_value mscb_hub_cpu.instruction_master/mscb_hub_ruc.s1 baseAddress 0x1800
add_connection mscb_hub_cpu.instruction_master ssram_tristate_controller.uas avalon
set_connection_parameter_value mscb_hub_cpu.instruction_master/ssram_tristate_controller.uas baseAddress 0x00080000
add_connection sgdma_rx.descriptor_read descriptor_memory.s1 avalon
set_connection_parameter_value sgdma_rx.descriptor_read/descriptor_memory.s1 baseAddress 0x3000
add_connection sgdma_rx.descriptor_write descriptor_memory.s1 avalon
set_connection_parameter_value sgdma_rx.descriptor_write/descriptor_memory.s1 baseAddress 0x3000
add_connection sgdma_rx.m_write ssram_tristate_controller.uas avalon
set_connection_parameter_value sgdma_rx.m_write/ssram_tristate_controller.uas baseAddress 0x00080000
add_connection sgdma_tx.descriptor_read descriptor_memory.s1 avalon
set_connection_parameter_value sgdma_tx.descriptor_read/descriptor_memory.s1 baseAddress 0x3000
add_connection sgdma_tx.descriptor_write descriptor_memory.s1 avalon
set_connection_parameter_value sgdma_tx.descriptor_write/descriptor_memory.s1 baseAddress 0x3000
add_connection sgdma_tx.m_read ssram_tristate_controller.uas avalon
set_connection_parameter_value sgdma_tx.m_read/ssram_tristate_controller.uas baseAddress 0x00080000
add_connection VIC.dummy_master VIC.csr_access avalon
set_connection_parameter_value VIC.dummy_master/VIC.csr_access baseAddress 0x2400
add_connection sgdma_tx.out tse_mac0.transmit avalon_streaming
add_connection tse_mac0.receive sgdma_rx.in avalon_streaming
add_connection VIC.interrupt_controller_out mscb_hub_cpu.interrupt_controller_in avalon_streaming
add_connection VIC.irq_input ADC_DReady_int.irq interrupt
set_connection_parameter_value VIC.irq_input/ADC_DReady_int.irq irqNumber 17
add_connection VIC.irq_input i_adc.irq interrupt
set_connection_parameter_value VIC.irq_input/i_adc.irq irqNumber 12
add_connection VIC.irq_input i_dac.irq interrupt
set_connection_parameter_value VIC.irq_input/i_dac.irq irqNumber 11
add_connection VIC.irq_input i_ext_gate.irq interrupt
set_connection_parameter_value VIC.irq_input/i_ext_gate.irq irqNumber 13
add_connection VIC.irq_input i_local.irq interrupt
set_connection_parameter_value VIC.irq_input/i_local.irq irqNumber 10
add_connection VIC.irq_input mscb_hub_epcs.irq interrupt
set_connection_parameter_value VIC.irq_input/mscb_hub_epcs.irq irqNumber 3
add_connection VIC.irq_input mscb_hub_jtag_uart.irq interrupt
set_connection_parameter_value VIC.irq_input/mscb_hub_jtag_uart.irq irqNumber 0
add_connection VIC.irq_input mscb_hub_sys_clk.irq interrupt
set_connection_parameter_value VIC.irq_input/mscb_hub_sys_clk.irq irqNumber 1
add_connection VIC.irq_input mscb_hub_sys_timestamp.irq interrupt
set_connection_parameter_value VIC.irq_input/mscb_hub_sys_timestamp.irq irqNumber 2
add_connection VIC.irq_input mscb_hub_uart.irq interrupt
set_connection_parameter_value VIC.irq_input/mscb_hub_uart.irq irqNumber 4
add_connection VIC.irq_input onewire_eeprom.irq interrupt
set_connection_parameter_value VIC.irq_input/onewire_eeprom.irq irqNumber 14
add_connection VIC.irq_input sgdma_rx.csr_irq interrupt
set_connection_parameter_value VIC.irq_input/sgdma_rx.csr_irq irqNumber 16
add_connection VIC.irq_input sgdma_tx.csr_irq interrupt
set_connection_parameter_value VIC.irq_input/sgdma_tx.csr_irq irqNumber 15
add_connection VIC.irq_input spi_adc1.irq interrupt
set_connection_parameter_value VIC.irq_input/spi_adc1.irq irqNumber 5
add_connection VIC.irq_input spi_adc2.irq interrupt
set_connection_parameter_value VIC.irq_input/spi_adc2.irq irqNumber 6
add_connection VIC.irq_input spi_dac1.irq interrupt
set_connection_parameter_value VIC.irq_input/spi_dac1.irq irqNumber 9
add_connection VIC.irq_input spi_dac2.irq interrupt
set_connection_parameter_value VIC.irq_input/spi_dac2.irq irqNumber 8
add_connection VIC.irq_input spi_dac3.irq interrupt
set_connection_parameter_value VIC.irq_input/spi_dac3.irq irqNumber 7
add_connection mscb_hub_cpu.custom_instruction_master nios_custom_instr_floating_point_0.s1 nios_custom_instruction
set_connection_parameter_value mscb_hub_cpu.custom_instruction_master/nios_custom_instr_floating_point_0.s1 CIName nios_custom_instr_floating_point_0
set_connection_parameter_value mscb_hub_cpu.custom_instruction_master/nios_custom_instr_floating_point_0.s1 baseAddress 252
add_connection ssram_tristate_controller.tcm ssram_tristate_conduit.tcs tristate_conduit

# exported interfaces
add_interface spi_dac3_external conduit end
set_interface_property spi_dac3_external EXPORT_OF spi_dac3.external
add_interface mscb_hub_epcs_external conduit end
set_interface_property mscb_hub_epcs_external EXPORT_OF mscb_hub_epcs.external
add_interface clk_ext_clk_in_reset reset sink
set_interface_property clk_ext_clk_in_reset EXPORT_OF clk_ext.clk_in_reset
add_interface mscb_hub_io_reset_external_connection conduit end
set_interface_property mscb_hub_io_reset_external_connection EXPORT_OF mscb_hub_io_reset.external_connection
add_interface i_dac_external_connection conduit end
set_interface_property i_dac_external_connection EXPORT_OF i_dac.external_connection
add_interface o_iq1_external_connection conduit end
set_interface_property o_iq1_external_connection EXPORT_OF o_iq1.external_connection
add_interface o_cal_external_connection conduit end
set_interface_property o_cal_external_connection EXPORT_OF o_cal.external_connection
add_interface i_ext_gate_external_connection conduit end
set_interface_property i_ext_gate_external_connection EXPORT_OF i_ext_gate.external_connection
add_interface onewire_eeprom_ext conduit end
set_interface_property onewire_eeprom_ext EXPORT_OF onewire_eeprom.ext
add_interface i_local_external_connection conduit end
set_interface_property i_local_external_connection EXPORT_OF i_local.external_connection
add_interface syspll_c3 clock source
set_interface_property syspll_c3 EXPORT_OF syspll.c3
add_interface ssram_tristate_conduit_out conduit end
set_interface_property ssram_tristate_conduit_out EXPORT_OF ssram_tristate_conduit.out
add_interface syspll_c2 clock source
set_interface_property syspll_c2 EXPORT_OF syspll.c2
add_interface syspll_c1 clock source
set_interface_property syspll_c1 EXPORT_OF syspll.c1
add_interface o_iq2_external_connection conduit end
set_interface_property o_iq2_external_connection EXPORT_OF o_iq2.external_connection
add_interface syspll_areset_conduit conduit end
set_interface_property syspll_areset_conduit EXPORT_OF syspll.areset_conduit
add_interface ssram_clk_out_clk_1 clock source
set_interface_property ssram_clk_out_clk_1 EXPORT_OF ssram_clk.out_clk_1
add_interface mscb_hub_uart_external_connection conduit end
set_interface_property mscb_hub_uart_external_connection EXPORT_OF mscb_hub_uart.external_connection
add_interface o_dac_external_connection conduit end
set_interface_property o_dac_external_connection EXPORT_OF o_dac.external_connection
add_interface syspll_phasedone_conduit conduit end
set_interface_property syspll_phasedone_conduit EXPORT_OF syspll.phasedone_conduit
add_interface o_local_external_connection conduit end
set_interface_property o_local_external_connection EXPORT_OF o_local.external_connection
add_interface syspll_locked_conduit conduit end
set_interface_property syspll_locked_conduit EXPORT_OF syspll.locked_conduit
add_interface clk_ext_clk_in clock sink
set_interface_property clk_ext_clk_in EXPORT_OF clk_ext.clk_in
add_interface adc1_ch1_data conduit end
set_interface_property adc1_ch1_data EXPORT_OF adc1_ch1_data.external_connection
add_interface adc1_ch2_data conduit end
set_interface_property adc1_ch2_data EXPORT_OF adc1_ch2_data.external_connection
add_interface adc2_ch1_data conduit end
set_interface_property adc2_ch1_data EXPORT_OF adc2_ch1_data.external_connection
add_interface adc2_ch2_data conduit end
set_interface_property adc2_ch2_data EXPORT_OF adc2_ch2_data.external_connection
add_interface adc1_ch1_iqcal conduit end
set_interface_property adc1_ch1_iqcal EXPORT_OF adc1_ch1_IQcal.external_connection
add_interface adc1_ch2_iqcal conduit end
set_interface_property adc1_ch2_iqcal EXPORT_OF adc1_ch2_IQcal.external_connection
add_interface adc2_ch1_iqcal conduit end
set_interface_property adc2_ch1_iqcal EXPORT_OF adc2_ch1_IQcal.external_connection
add_interface adc2_ch2_iqcal conduit end
set_interface_property adc2_ch2_iqcal EXPORT_OF adc2_ch2_IQcal.external_connection
add_interface iqcal_dready conduit end
set_interface_property iqcal_dready EXPORT_OF IQcal_DReady.external_connection
add_interface adc_dready_int conduit end
set_interface_property adc_dready_int EXPORT_OF ADC_DReady_int.external_connection
add_interface xycal_dready conduit end
set_interface_property xycal_dready EXPORT_OF XYcal_DReady.external_connection
add_interface xycal_offsets conduit end
set_interface_property xycal_offsets EXPORT_OF XYcal_offsets.external_connection
add_interface tse_mac0_pcs_mac_tx_clock clock sink
set_interface_property tse_mac0_pcs_mac_tx_clock EXPORT_OF tse_mac0.pcs_mac_tx_clock_connection
add_interface tse_mac0_pcs_mac_rx_clock clock sink
set_interface_property tse_mac0_pcs_mac_rx_clock EXPORT_OF tse_mac0.pcs_mac_rx_clock_connection
add_interface tse_mac0_mac_status conduit end
set_interface_property tse_mac0_mac_status EXPORT_OF tse_mac0.mac_status_connection
add_interface tse_mac0_mac_gmii conduit end
set_interface_property tse_mac0_mac_gmii EXPORT_OF tse_mac0.mac_gmii_connection
add_interface tse_mac0_mac_mii conduit end
set_interface_property tse_mac0_mac_mii EXPORT_OF tse_mac0.mac_mii_connection
add_interface tse_mac0_mac_mdio conduit end
set_interface_property tse_mac0_mac_mdio EXPORT_OF tse_mac0.mac_mdio_connection
add_interface tse_mac0_mac_misc conduit end
set_interface_property tse_mac0_mac_misc EXPORT_OF tse_mac0.mac_misc_connection
add_interface syspll_c4 conduit end
set_interface_property syspll_c4 EXPORT_OF syspll.c4_conduit
add_interface o_iq_reset conduit end
set_interface_property o_iq_reset EXPORT_OF o_iq_reset.external_connection
add_interface i_status conduit end
set_interface_property i_status EXPORT_OF i_status.external_connection
add_interface o_status conduit end
set_interface_property o_status EXPORT_OF o_status.external_connection
add_interface xycal_gains conduit end
set_interface_property xycal_gains EXPORT_OF XYcal_gains.external_connection

set_interconnect_requirement {$system} qsys_mm.clockCrossingAdapter AUTO
set_interconnect_requirement {$system} qsys_mm.maxAdditionalLatency 2

save_system VIL.qsys
